# EAGLE schematic pavement_painter_v5 (EAGLE 9.3.2)
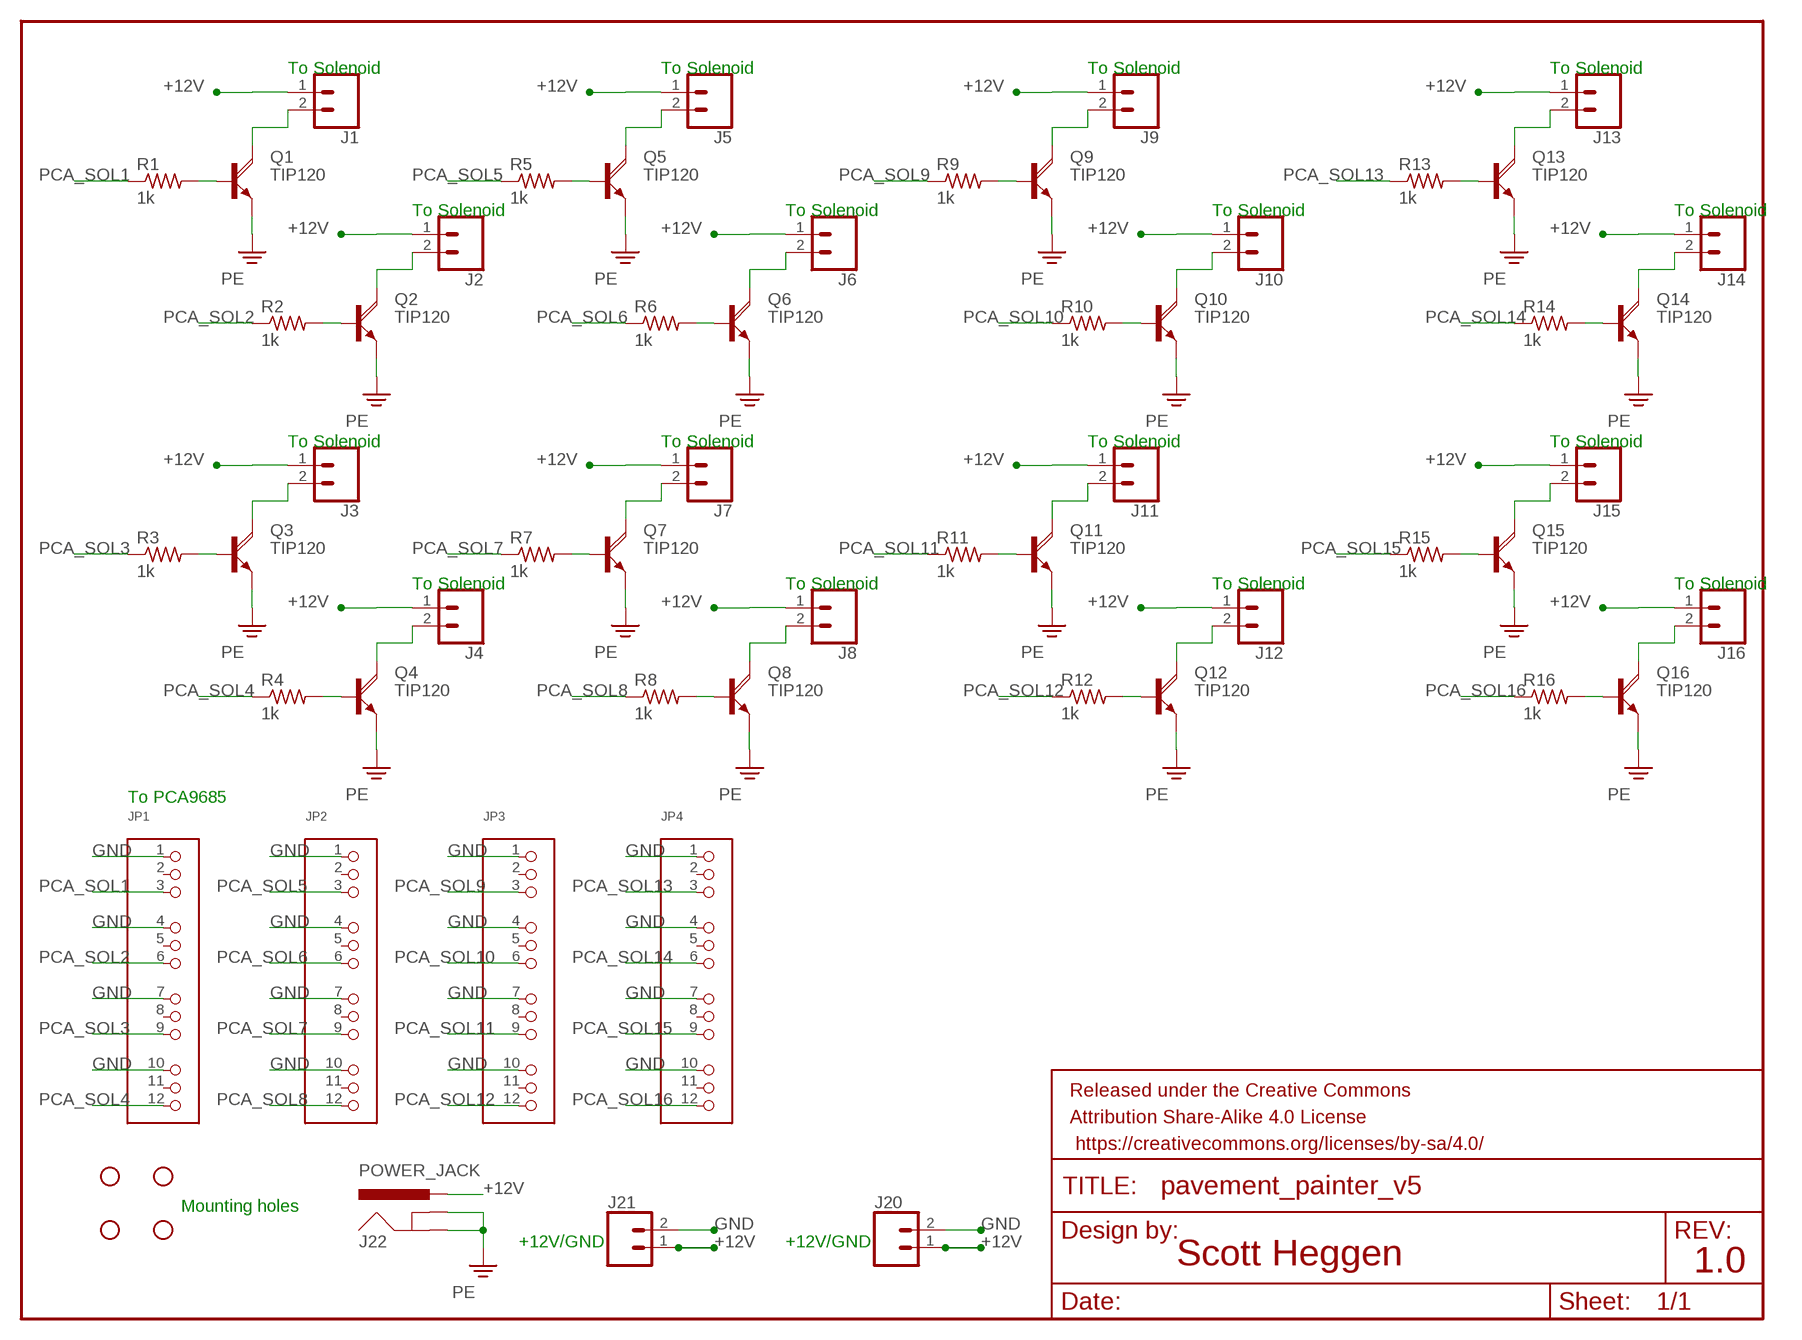
[diagram p0: schematic, sheet 1]

## Parts
FRAME1  FRAME-LETTER  [CREATIVE_COMMONS]
H1  STAND-OFF  [STAND-OFF]
H2  STAND-OFF  [STAND-OFF]
H3  STAND-OFF  [STAND-OFF]
H4  STAND-OFF  [STAND-OFF]
J1  CONN_02SCREWTERMINAL-200MIL-400MIL  [SCREWTERMINAL-5MM-2-400MIL]
J2  CONN_02SCREWTERMINAL-200MIL-400MIL  [SCREWTERMINAL-5MM-2-400MIL]
J3  CONN_02SCREWTERMINAL-200MIL-400MIL  [SCREWTERMINAL-5MM-2-400MIL]
J4  CONN_02SCREWTERMINAL-200MIL-400MIL  [SCREWTERMINAL-5MM-2-400MIL]
J5  CONN_02SCREWTERMINAL-200MIL-400MIL  [SCREWTERMINAL-5MM-2-400MIL]
J6  CONN_02SCREWTERMINAL-200MIL-400MIL  [SCREWTERMINAL-5MM-2-400MIL]
J7  CONN_02SCREWTERMINAL-200MIL-400MIL  [SCREWTERMINAL-5MM-2-400MIL]
J8  CONN_02SCREWTERMINAL-200MIL-400MIL  [SCREWTERMINAL-5MM-2-400MIL]
J9  CONN_02SCREWTERMINAL-200MIL-400MIL  [SCREWTERMINAL-5MM-2-400MIL]
J10  CONN_02SCREWTERMINAL-200MIL-400MIL  [SCREWTERMINAL-5MM-2-400MIL]
J11  CONN_02SCREWTERMINAL-200MIL-400MIL  [SCREWTERMINAL-5MM-2-400MIL]
J12  CONN_02SCREWTERMINAL-200MIL-400MIL  [SCREWTERMINAL-5MM-2-400MIL]
J13  CONN_02SCREWTERMINAL-200MIL-400MIL  [SCREWTERMINAL-5MM-2-400MIL]
J14  CONN_02SCREWTERMINAL-200MIL-400MIL  [SCREWTERMINAL-5MM-2-400MIL]
J15  CONN_02SCREWTERMINAL-200MIL-400MIL  [SCREWTERMINAL-5MM-2-400MIL]
J16  CONN_02SCREWTERMINAL-200MIL-400MIL  [SCREWTERMINAL-5MM-2-400MIL]
J20  CONN_02SCREWTERMINAL-200MIL-400MIL  [SCREWTERMINAL-5MM-2-400MIL]
J21  CONN_02SCREWTERMINAL-200MIL-400MIL  [SCREWTERMINAL-5MM-2-400MIL]
J22  POWER_JACK  [POWER_JACK_PTH]
JP1  HEADER-3X04  [3X04]
JP2  HEADER-3X04  [3X04]
JP3  HEADER-3X04  [3X04]
JP4  HEADER-3X04  [3X04]
Q1  TIP120  [BD679V]
Q2  TIP120  [BD679V]
Q3  TIP120  [BD679V]
Q4  TIP120  [BD679V]
Q5  TIP120  [BD679V]
Q6  TIP120  [BD679V]
Q7  TIP120  [BD679V]
Q8  TIP120  [BD679V]
Q9  TIP120  [BD679V]
Q10  TIP120  [BD679V]
Q11  TIP120  [BD679V]
Q12  TIP120  [BD679V]
Q13  TIP120  [BD679V]
Q14  TIP120  [BD679V]
Q15  TIP120  [BD679V]
Q16  TIP120  [BD679V]
R1  1k  R-US_0207/10  [0207/10]
R2  1k  R-US_0207/10  [0207/10]
R3  1k  R-US_0207/10  [0207/10]
R4  1k  R-US_0207/10  [0207/10]
R5  1k  R-US_0207/10  [0207/10]
R6  1k  R-US_0207/10  [0207/10]
R7  1k  R-US_0207/10  [0207/10]
R8  1k  R-US_0207/10  [0207/10]
R9  1k  R-US_0207/10  [0207/10]
R10  1k  R-US_0207/10  [0207/10]
R11  1k  R-US_0207/10  [0207/10]
R12  1k  R-US_0207/10  [0207/10]
R13  1k  R-US_0207/10  [0207/10]
R14  1k  R-US_0207/10  [0207/10]
R15  1k  R-US_0207/10  [0207/10]
R16  1k  R-US_0207/10  [0207/10]

## Nets
+12V: J1.1 J2.1 J3.1 J4.1 J5.1 J6.1 J7.1 J8.1 J9.1 J10.1 J11.1 J12.1 J13.1 J14.1 J15.1 J16.1 J20.1 J21.1 J22.PWR
GND: J20.2 J21.2 J22.GND J22.GNDBREAK JP1.1 JP1.4 JP1.7 JP1.10 JP2.1 JP2.4 JP2.7 JP2.10 JP3.1 JP3.4 JP3.7 JP3.10 JP4.1 JP4.4 JP4.7 JP4.10 Q1.E Q2.E Q3.E Q4.E Q5.E Q6.E Q7.E Q8.E Q9.E Q10.E Q11.E Q12.E Q13.E Q14.E Q15.E Q16.E ; supply symbol labelled PE
N$1: J2.2 Q2.C
N$2: Q2.B R2.2
N$3: J1.2 Q1.C
N$4: Q1.B R1.2
N$5: J3.2 Q3.C
N$6: Q3.B R3.2
N$7: J4.2 Q4.C
N$8: Q4.B R4.2
N$9: J5.2 Q5.C
N$10: Q5.B R5.2
N$11: J6.2 Q6.C
N$12: Q6.B R6.2
N$13: J7.2 Q7.C
N$14: Q7.B R7.2
N$15: J8.2 Q8.C
N$16: Q8.B R8.2
N$17: J9.2 Q9.C
N$18: Q9.B R9.2
N$19: J10.2 Q10.C
N$20: Q10.B R10.2
N$21: J11.2 Q11.C
N$22: Q11.B R11.2
N$23: J12.2 Q12.C
N$24: Q12.B R12.2
N$25: J13.2 Q13.C
N$26: Q13.B R13.2
N$27: J14.2 Q14.C
N$28: Q14.B R14.2
N$29: J15.2 Q15.C
N$30: Q15.B R15.2
N$31: J16.2 Q16.C
N$32: Q16.B R16.2
PCA_SOL1: JP1.3 R1.1
PCA_SOL2: JP1.6 R2.1
PCA_SOL3: JP1.9 R3.1
PCA_SOL4: JP1.12 R4.1
PCA_SOL5: JP2.3 R5.1
PCA_SOL6: JP2.6 R6.1
PCA_SOL7: JP2.9 R7.1
PCA_SOL8: JP2.12 R8.1
PCA_SOL9: JP3.3 R9.1
PCA_SOL10: JP3.6 R10.1
PCA_SOL11: JP3.9 R11.1
PCA_SOL12: JP3.12 R12.1
PCA_SOL13: JP4.3 R13.1
PCA_SOL14: JP4.6 R14.1
PCA_SOL15: JP4.9 R15.1
PCA_SOL16: JP4.12 R16.1
Unconnected: JP1.2 JP1.5 JP1.8 JP1.11 JP2.2 JP2.5 JP2.8 JP2.11 JP3.2 JP3.5 JP3.8 JP3.11 JP4.2 JP4.5 JP4.8 JP4.11

## Notes on the sheet
- To Solenoid | To Solenoid | To Solenoid | To Solenoid
- To Solenoid | To Solenoid | To Solenoid | To Solenoid
- To Solenoid | To Solenoid | To Solenoid | To Solenoid
- To Solenoid | To Solenoid | To Solenoid | To Solenoid
- To PCA9685
- Mounting holes
- +12V/GND | +12V/GND
- Scott Heggen | 1.0

## Library data of the parts
FRAME1 = SparkFun-Aesthetics:FRAME-LETTER: Schematic Frame - Letter Standard 8.5x11 US Letter frame
H1-H4 = SparkFun-Hardware:STAND-OFF: Stand Off Drill holes for mechanically mounting via screws, standoffs, etc. Note: Use the keepout ring to avoid running the screw head into surrounding components. Variant Overviews STAND-OFF - Mechanical footprint for a #4 phillips button head screw. STAND-OFF-TIGHT - Mechanical footprint for a #4 phillips button head screw, Example SparkFun Products Screw - Phillips Head (1/4", 4-40, 10 pack) <https://www.sparkfun.com/products/10453> (PRT-10453) Screw - Phillips Head (1/2", 4-40, 10 pack) <https://www.sparkfun.com/products/10452> (PRT-10452) Screw - Phillips Head (3/4", 4-40, 10 pack) <https://www.sparkfun.com/products/10451> (PRT-10451) Screw - Phillips Head (1", 4-40, 10 pack) <https://www.sparkfun.com/products/10450> (PRT-10450)
J1-J16 J20 J21 = SparkFun-Connectors:CONN_02: Multi connection point. Often used as Generic Header-pin footprint for 0.1 inch spaced/style header connections On any of the 0.1 inch spaced packages, you can populate with these: Break Away Headers - Straight <https://www.sparkfun.com/products/116> (PRT-00116) Break Away Male Headers - Right Angle <https://www.sparkfun.com/products/553> (PRT-00553) Female Headers <https://www.sparkfun.com/products/115> (PRT-00115) Break Away Headers - Machine Pin <https://www.sparkfun.com/products/117> (PRT-00117) Break Away Female Headers - Swiss Machine Pin <https://www.sparkfun.com/products/743> (PRT-00743) For SCREWTERMINALS and SPRING TERMINALS visit here: Screw Terimnals on SparkFun.com <https://www.sparkfun.com/search/results?term=Screw+Terminals> (5mm/3.5mm/2.54mm spacing) This device is also useful as a general connection point to wire up your design to another part of your project. Our various solder wires solder well into these plated through hole pads. Hook-Up Wire - Assortment (Stranded, 22 AWG) <https://www.sparkfun.com/products/11375> (PRT-11375) Hook-Up Wire - Assortment (Solid Core, 22 AWG) <https://www.sparkfun.com/products/11367> (PRT-11367) View the entire wire category on our website here <https://www.sparkfun.com/categories/141> Special notes: Molex polarized connector foot print use with: PRT-08233 with associated crimp pins and housings. 2.54_SCREWTERM for use with PRT-10571. 3.5mm Screw Terminal footprints for PRT-08084 5mm Screw Terminal footprints for use with PRT-08432
J22 = SparkFun-Connectors:POWER_JACK: Power Jack Connector This is the standard 5.5mm barrel jack for power. The PTH is the most common, proven, reliable, footprint. The Slot footprint only works if the mill layer is transmitted to the PCB fab house so be warned. Here are the connectors we sell at SparkFun: DC Barrel Power Jack/Connector <https://www.sparkfun.com/products/119> (PRT-00119) DC Barrel Power Jack/Connector (SMD) <https://www.sparkfun.com/products/12748> (PRT-12748) DC Barrel Jack Adapter - Breadboard Compatible <https://www.sparkfun.com/products/10811> (PRT-10811) It is used on this SparkFun product (and many, many others): SparkFun RedBoard - Programmed with Arduino <https://www.sparkfun.com/products/12757> (DEV-12757) Also, if you need a mating power supply or connector, please check these out: Wall Adapter Power Supply - 9VDC 650mA <https://www.sparkfun.com/products/298> (TOL-00298) DC Barrel Jack Adapter - Male <https://www.sparkfun.com/products/10287> (PRT-10287); PROD_ID: CONN-08197
JP1-JP4 = microbuilder:HEADER-3X04
Q1-Q16 = TIP120:TIP120: NPN DARLINGTON TRANSISTOR
R1-R16 = rcl:R-US_: RESISTOR, American symbol; SPICEPREFIX: R